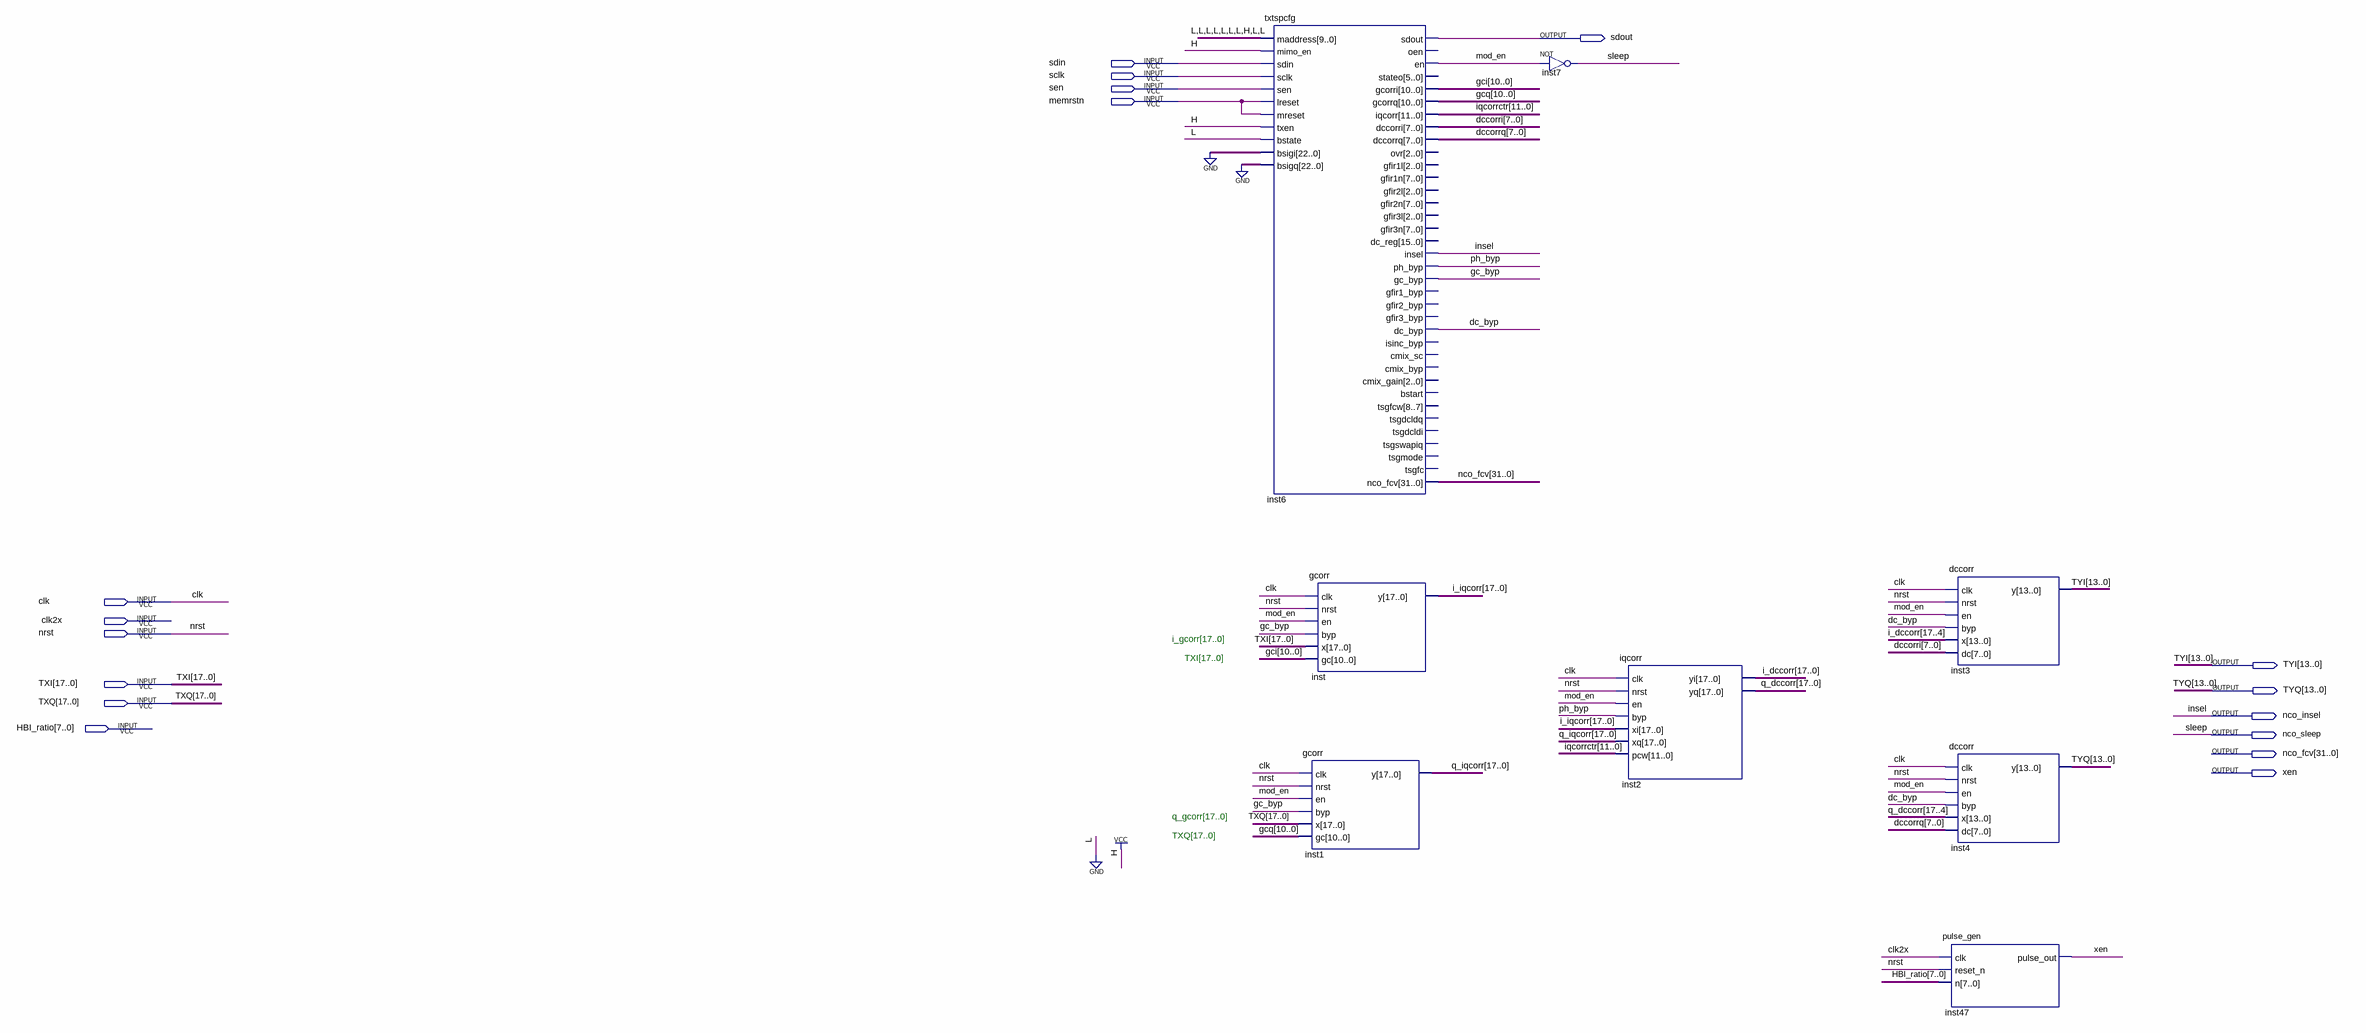
[diagram p0: schematic sheet]
// Quartus schematic tx_chain.bdf as structural Verilog: 8 symbols, 17 pins
module tx_chain (
  input  sdin,
  input  sclk,
  input  sen,
  input  memrstn,
  input  clk,
  input  clk2x,
  input  nrst,
  input  [17:0] TXI,
  input  [17:0] TXQ,
  input  [7:0] HBI_ratio,
  output sdout,
  output [13:0] TYI,
  output [13:0] TYQ,
  output nco_insel,
  output nco_sleep,
  output [31:0] nco_fcv,
  output xen
);

  wire dc_byp, gc_byp, mod_en, ph_byp;
  wire [7:0] dccorri, dccorrq;
  wire [10:0] gci, gcq;
  wire [11:0] iqcorrctr;
  wire [17:0] i_dccorr, i_iqcorr, q_dccorr, q_iqcorr;

  txtspcfg inst6 (
    .maddress(10'b0000000100), .mimo_en(1'b1), .sdin(sdin), .sclk(sclk), .sen(sen), .lreset(memrstn),
    .mreset(memrstn), .txen(1'b1), .bstate(1'b0), .bsigi({23{1'b0}}), .bsigq({23{1'b0}}), .sdout(sdout),
    .en(mod_en), .gcorri(gci), .gcorrq(gcq), .iqcorr(iqcorrctr), .dccorri(dccorri), .dccorrq(dccorrq),
    .insel(nco_insel), .ph_byp(ph_byp), .gc_byp(gc_byp), .dc_byp(dc_byp), .nco_fcv(nco_fcv));  // open: oen, stateo, ovr, gfir1l, gfir1n, gfir2l, gfir2n, gfir3l, gfir3n, dc_reg, gfir1_byp, gfir2_byp, gfir3_byp, isinc_byp, cmix_sc, cmix_byp, cmix_gain, bstart, tsgfcw, tsgdcldq, tsgdcldi, tsgswapiq, tsgmode, tsgfc
  gcorr inst (.clk(clk), .nrst(nrst), .en(mod_en), .byp(gc_byp), .x(TXI), .gc(gci), .y(i_iqcorr));
  gcorr inst1 (.clk(clk), .nrst(nrst), .en(mod_en), .byp(gc_byp), .x(TXQ), .gc(gcq), .y(q_iqcorr));
  not inst7 (nco_sleep, mod_en);
  iqcorr inst2 (
    .clk(clk), .nrst(nrst), .en(mod_en), .byp(ph_byp), .xi(i_iqcorr), .xq(q_iqcorr), .pcw(iqcorrctr),
    .yi(i_dccorr), .yq(q_dccorr));
  dccorr inst3 (.clk(clk), .nrst(nrst), .en(mod_en), .byp(dc_byp), .x(i_dccorr[17:4]), .dc(dccorri), .y(TYI));
  dccorr inst4 (.clk(clk), .nrst(nrst), .en(mod_en), .byp(dc_byp), .x(q_dccorr[17:4]), .dc(dccorrq), .y(TYQ));
  pulse_gen inst47 (.clk(clk2x), .reset_n(nrst), .n(HBI_ratio), .pulse_out(xen));

  // Other names for the same wires on the sheet: insel = nco_insel; sleep = nco_sleep

  // Notes on the sheet:
  //   i_gcorr[17..0]
  //   TXI[17..0]
  //   q_gcorr[17..0]
  //   TXQ[17..0]
endmodule
